# EAGLE schematic tennisfortwof303 (EAGLE 9.6.2)
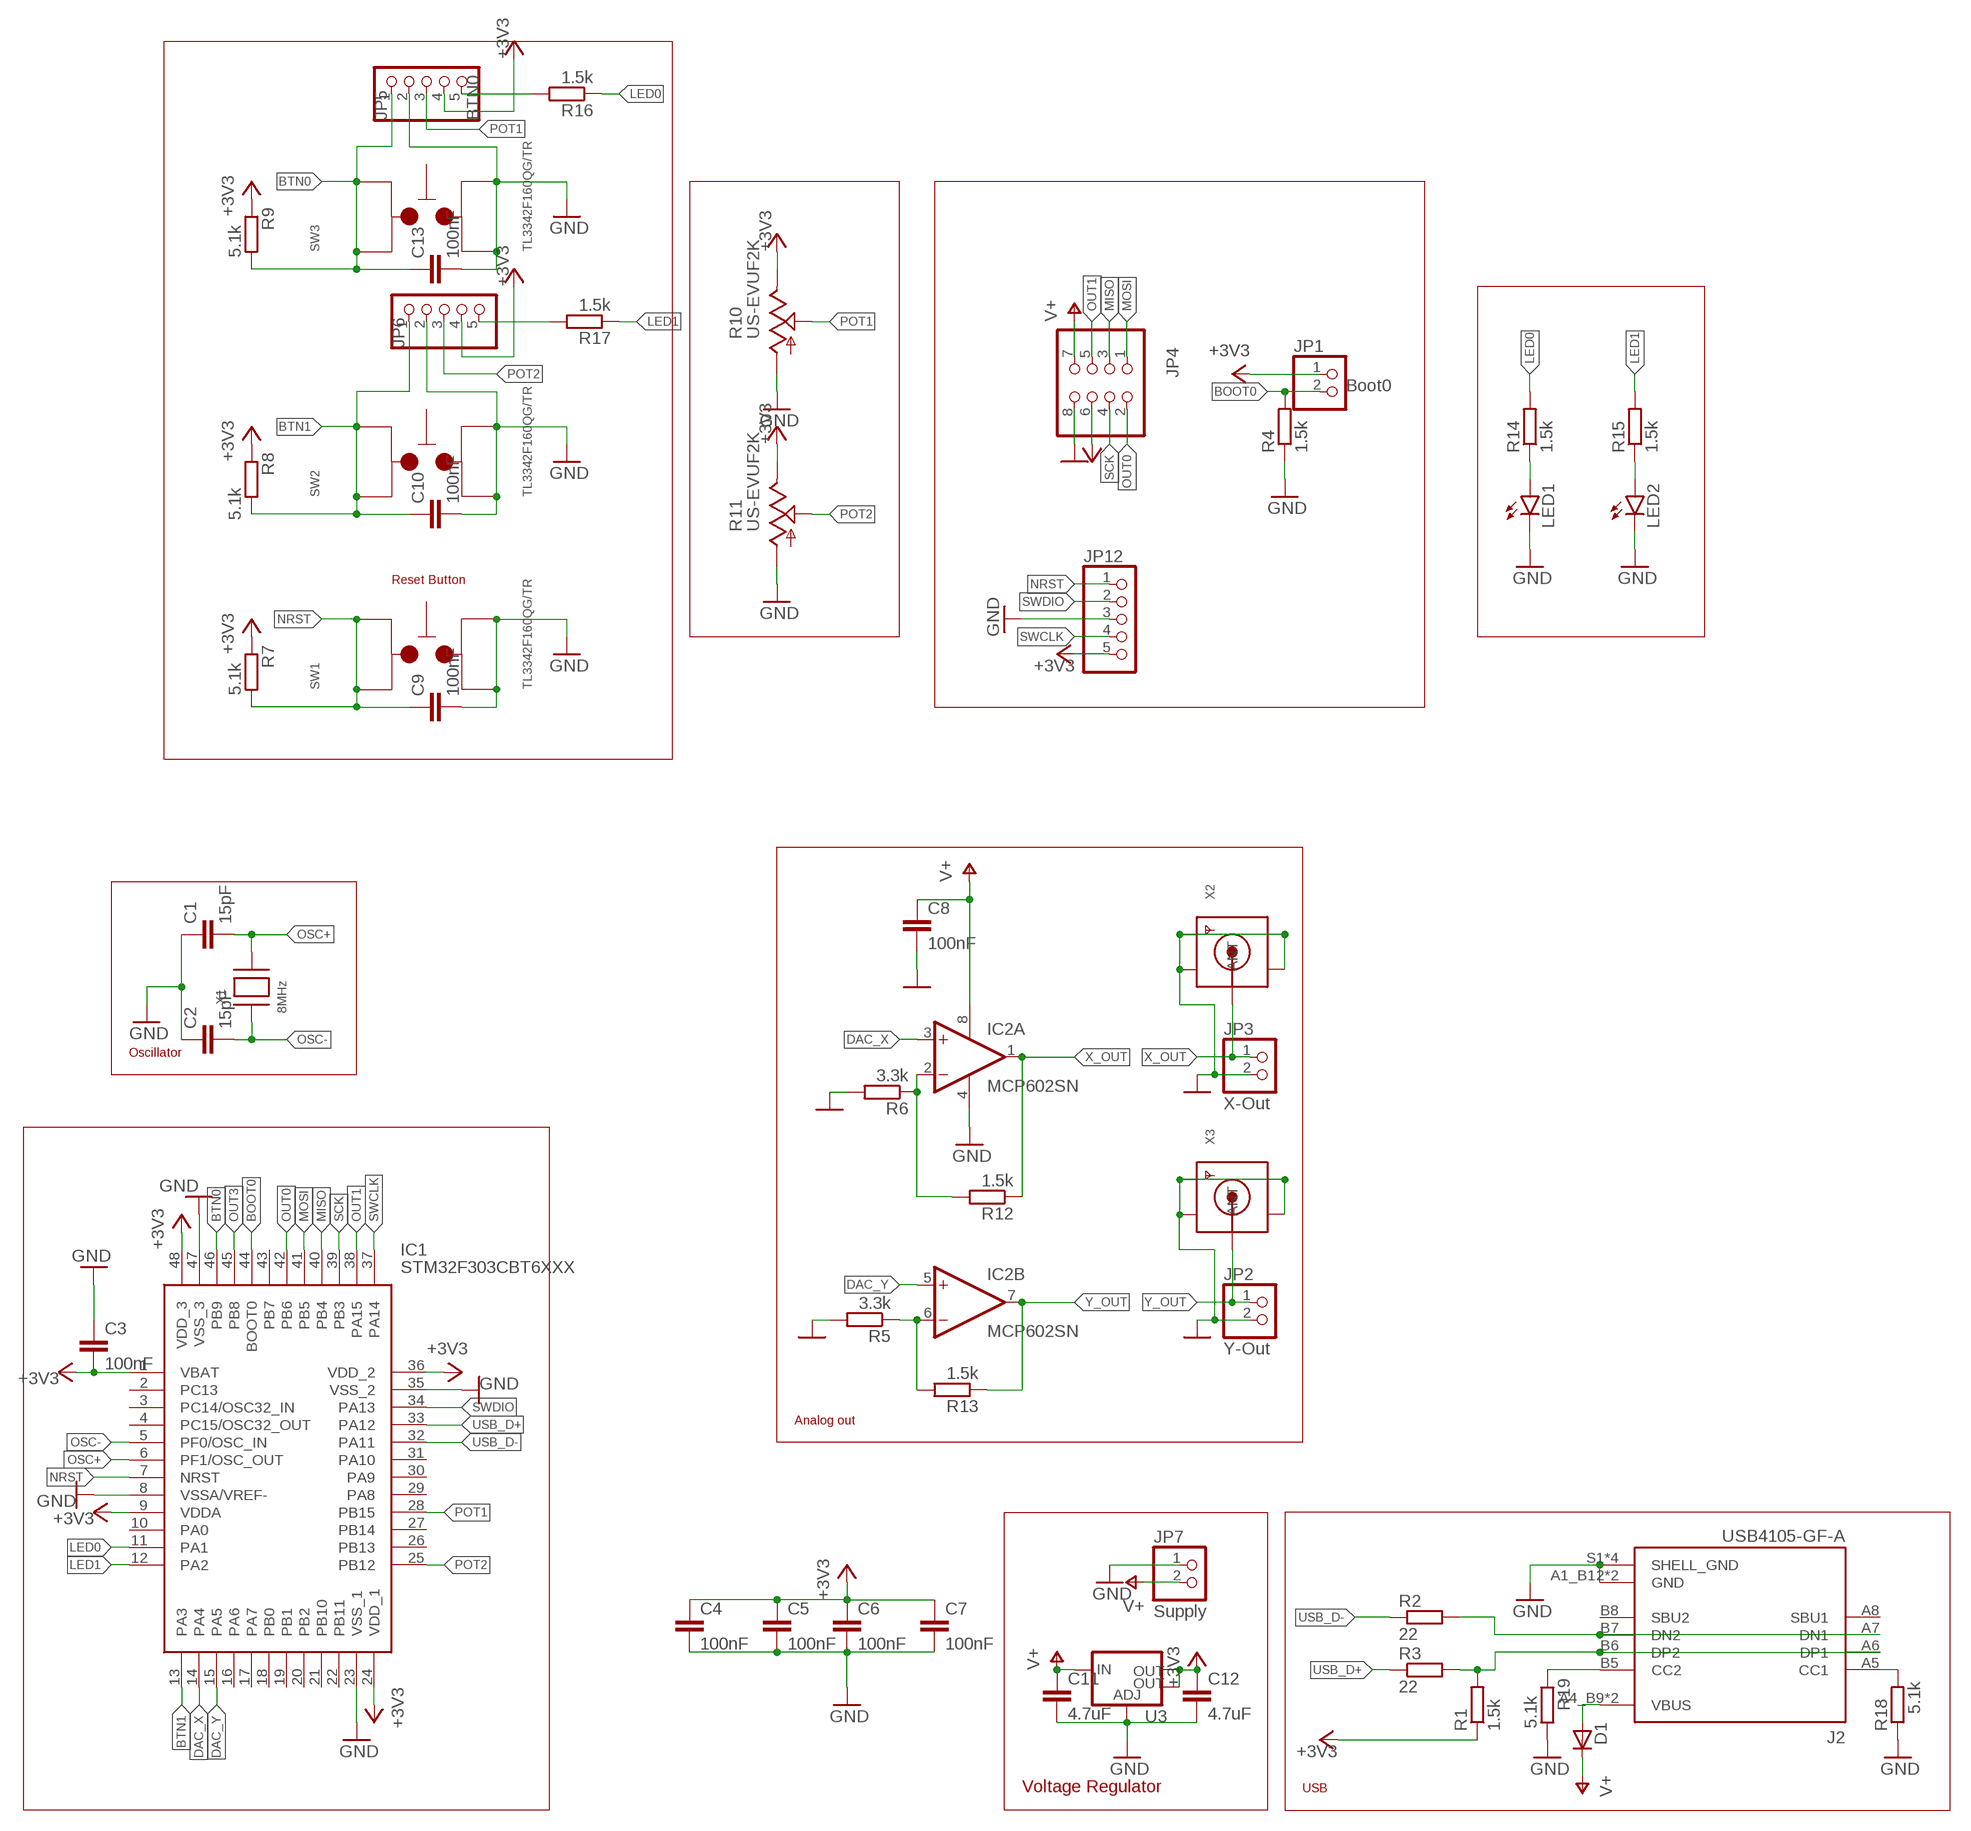
[diagram p0: schematic, sheet 1]

## Parts
C1  15pF  C-EUC0603  [C0603]
C2  15pF  C-EUC0603  [C0603]
C3  100nF  C-EUC0603  [C0603]
C4  100nF  C-EUC0603  [C0603]
C5  100nF  C-EUC0603  [C0603]
C6  100nF  C-EUC0603  [C0603]
C7  100nF  C-EUC0603  [C0603]
C8  100nF  C-EUC0603  [C0603]
C9  100nF  C-EUC0603  [C0603]
C10  100nF  C-EUC0603  [C0603]
C11  4.7uF  C-EUC0805  [C0805]
C12  4.7uF  C-EUC0805  [C0805]
C13  100nF  C-EUC0603  [C0603]
D1  DIODESMA  [SMADIODE]
IC1  STM32F303CBT6XXX  [QFP50P900X900X160-48N]
IC2  MCP602SN  [SO08]
J2  USB4105-GF-A  [GCT_USB4105-GF-A]
JP1  Boot0  PINHD-1X2  [1X02]
JP2  Y-Out  PINHD-1X2  [1X02]
JP3  X-Out  PINHD-1X2  [1X02]
JP4  PINHD-2X4  [2X04]
JP5  BTN0  PINHD-1X5/90  [1X05/90]
JP6  BTN1  PINHD-1X5/90  [1X05/90]
JP7  Supply  PINHD-1X2  [1X02]
JP12  PINHD-1X5  [1X05]
LED1  LEDCHIPLED_0805  [CHIPLED_0805]
LED2  LEDCHIPLED_0805  [CHIPLED_0805]
R1  1.5k  R-EU_R0603  [R0603]
R2  22  R-EU_R0603  [R0603]
R3  22  R-EU_R0603  [R0603]
R4  1.5k  R-EU_R0603  [R0603]
R5  3.3k  R-EU_R0603  [R0603]
R6  3.3k  R-EU_R0603  [R0603]
R7  5.1k  R-EU_R0603  [R0603]
R8  5.1k  R-EU_R0603  [R0603]
R9  5.1k  R-EU_R0603  [R0603]
R10  US-EVUF2K  [EVUFXK]
R11  US-EVUF2K  [EVUFXK]
R12  1.5k  R-EU_R0603  [R0603]
R13  1.5k  R-EU_R0603  [R0603]
R14  1.5k  R-EU_R0603  [R0603]
R15  1.5k  R-EU_R0603  [R0603]
R16  1.5k  R-EU_R0603  [R0603]
R17  1.5k  R-EU_R0603  [R0603]
R18  5.1k  R-EU_R0603  [R0603]
R19  5.1k  R-EU_R0603  [R0603]
SW1  TL3342F160QG/TR  [TL3342F160QG/TR]
SW2  TL3342F160QG/TR  [TL3342F160QG/TR]
SW3  TL3342F160QG/TR  [TL3342F160QG/TR]
U3  V_REG_LM1117SOT223  [SOT223]
X1  8MHz  XTALNX5032  [NX5032]
X2  SMACONNECTOR_EDGE  [SMA_EDGELAUNCH]
X3  SMACONNECTOR_EDGE  [SMA_EDGELAUNCH]

## Nets
+3V3: C3.2 C4.1 C5.1 C6.1 C7.1 C12.1 IC1.1(VBAT) IC1.9(VDDA) IC1.24(VDD_1) IC1.36(VDD_2) IC1.48(VDD_3) JP1.1 JP4.6 JP5.4 JP6.4 JP12.5 R1.1 R7.1 R8.1 R9.1 R10.3(E) R11.3(E) U3.2(OUT) U3.4(OUT)
BOOT0: IC1.44(BOOT0) JP1.2 R4.2
BTN0: C13.1 IC1.46(PB9) JP5.1 R9.2 SW3.3 SW3.4
BTN1: C10.1 IC1.13(PA3) JP6.1 R8.2 SW2.3 SW2.4
DAC_X: IC1.14(PA4) IC2.3(A:+IN)
DAC_Y: IC1.15(PA5) IC2.5(B:+IN)
GND: C1.1 C2.1 C3.1 C4.2 C5.2 C6.2 C7.2 C8.2 C9.2 C10.2 C11.2 C12.2 C13.2 IC1.8(VSSA/VREF-) IC1.23(VSS_1) IC1.35(VSS_2) IC1.47(VSS_3) IC2.4(P:V-) J2.A1_B12(GND) J2.B1_A12(GND) J2.S1(SHELL_GND) J2.S2(SHELL_GND) J2.S3(SHELL_GND) J2.S4(SHELL_GND) JP2.2 JP3.2 JP4.8 JP5.2 JP6.2 JP7.1 JP12.3 LED1.C LED2.C R4.1 R5.2 R6.2 R10.1(A) R11.1(A) R18.1 R19.2 SW1.1 SW1.2 SW2.1 SW2.2 SW3.1 SW3.2 U3.1(ADJ) X2.GND@1(GND4) X2.GND@2(GND3) X2.GND@3(GND2) X2.GND@4(GND1) X3.GND@1(GND4) X3.GND@2(GND3) X3.GND@3(GND2) X3.GND@4(GND1)
LED0: IC1.11(PA1) R14.2 R16.1
LED1: IC1.12(PA2) R15.2 R17.1
MISO: IC1.40(PB4) JP4.3
MOSI: IC1.41(PB5) JP4.1
N$2: D1.A J2.A4_B9(VBUS) J2.B4_A9(VBUS)
N$3: LED1.A R14.1
N$4: LED2.A R15.1
N$5: J2.A7(DN1) J2.B7(DN2) R2.2
N$6: J2.A6(DP1) J2.B6(DP2) R1.2 R3.2
N$7: IC2.2(A:-IN) R6.1 R12.2
N$8: IC2.6(B:-IN) R5.1 R13.2
N$9: JP5.5 R16.2
N$10: JP6.5 R17.2
N$11: J2.A5(CC1) R18.2
N$12: J2.B5(CC2) R19.1
NRST: C9.1 IC1.7(NRST) JP12.1 R7.2 SW1.3 SW1.4
OSC+: C1.2 IC1.6(PF1/OSC_OUT) X1.P$2
OSC-: C2.2 IC1.5(PF0/OSC_IN) X1.P$1
OUT0: IC1.42(PB6) JP4.2
OUT1: IC1.38(PA15) JP4.5
OUT3: IC1.45(PB8)
POT1: IC1.28(PB15) JP5.3 R10.2(S)
POT2: IC1.25(PB12) JP6.3 R11.2(S)
SCK: IC1.39(PB3) JP4.4
SWCLK: IC1.37(PA14) JP12.4
SWDIO: IC1.34(PA13) JP12.2
USB_D+: IC1.33(PA12) R3.1
USB_D-: IC1.32(PA11) R2.1
V+: C8.1 C11.1 D1.C IC2.8(P:V+) JP4.7 JP7.2 U3.3(IN)
X_OUT: IC2.1(A:OUT) JP3.1 R12.1 X2.P(ANT)
Y_OUT: IC2.7(B:OUT) JP2.1 R13.1 X3.P(ANT)
Unconnected: IC1.2(PC13) IC1.3(PC14/OSC32_IN) IC1.4(PC15/OSC32_OUT) IC1.10(PA0) IC1.16(PA6) IC1.17(PA7) IC1.18(PB0) IC1.19(PB1) IC1.20(PB2) IC1.21(PB10) IC1.22(PB11) IC1.26(PB13) IC1.27(PB14) IC1.29(PA8) IC1.30(PA9) IC1.31(PA10) IC1.43(PB7) J2.A8(SBU1) J2.B8(SBU2)

## Notes on the sheet
- Reset Button
- Oscillator
- Analog out
- Voltage Regulator | USB

## Library data of the parts
C1-C13 = resistor:C-EU: CAPACITOR, European symbol
D1 = adafruit:DIODE: Diode SMADIODE - SMA Surface Mount Package 20V 1A Schottky Diode Digikey: 641-1014-6-ND DO-1N4148 - Through Hole Small Current Diode SOD-123 20V 1 A (.5mV Vf) Schottky Diode - Digikey: MBRX120TPMSCT-ND SOD-323 10V 570mA (.38mV Vf, 3ns) Schottky Diode - Digikey: ZLLS410CT-ND SOD-523 30V 30mA Schottky Diode (RB751S-40TE61) - Digikey: RB751S-40TE61CT-ND SOT23-R/W - SOT23 Package (R = Solder Paste/Reflow Ovens, W = Hand-Soldering) BAT54Film 40V 300mA - Digikey: 497-7162-1-ND
IC1 = SamacSys_Parts:STM32F303CBT6XXX: STM32F303CBT6XXX Source: Datasheet <https://4donline.ihs.com/images/VipMasterIC/IC/SGST/SGST-S-A0006621340/SGST-S-A0006621340-1.pdf?hkey=EF798316E3902B6ED9A73243A3159BB0>; DESCRIPTION: STM32F303CBT6XXX; HEIGHT: 1.6mm; MANUFACTURER_NAME: STMicroelectronics; MANUFACTURER_PART_NUMBER: STM32F303CBT6XXX
IC2 = linear:MCP602: Single Op Amp 2.7V to 6.0V Single Supply CMOS Source: http://ww1.microchip.com/downloads/en/DeviceDoc/21314g.pdf
J2 = USB4105-GF-A:USB4105-GF-A: USB-C (USB TYPE-C) USB 2.0 Receptacle Connector 24 (16+8 Dummy) Position Surface Mount, Right Angle; Through Hole Check availability <https://pricing.snapeda.com/parts/USB4105-GF-A/GCT/view-part?ref=eda>; AVAILABILITY: In Stock; DESCRIPTION: USB-C (USB TYPE-C) USB 2.0 Receptacle Connector 24 (16+8 Dummy) Position Surface Mount, Right Angle; Through Hole; MF: GCT; MP: USB4105-GF-A; PACKAGE: None; PRICE: None; PURCHASE-URL: https://pricing.snapeda.com/search/part/USB4105-GF-A/?ref=eda
JP1-JP3 JP7 = pinhead:PINHD-1X2: PIN HEADER
JP4 = pinhead:PINHD-2X4: PIN HEADER
JP5 JP6 JP12 = pinhead:PINHD-1X5: PIN HEADER
LED1 LED2 = led:LED: LED OSRAM: - CHIPLED LG R971, LG N971, LY N971, LG Q971, LY Q971, LO R971, LY R971 LH N974, LH R974 LS Q976, LO Q976, LY Q976 LO Q996 - Hyper CHIPLED LW Q18S LB Q993, LB Q99A, LB R99A - SideLED LS A670, LO A670, LY A670, LG A670, LP A670 LB A673, LV A673, LT A673, LW A673 LH A674 LY A675 LS A676, LA A676, LO A676, LY A676, LW A676 LS A679, LY A679, LG A679 - Hyper Micro SIDELED® LS Y876, LA Y876, LO Y876, LY Y876 LT Y87S - SmartLED LW L88C, LW L88S LB L89C, LB L89S, LG L890 LS L89K, LO L89K, LY L89K LS L896, LA L896, LO L896, LY L896 - TOPLED LS T670, LO T670, LY T670, LG T670, LP T670 LSG T670, LSP T670, LSY T670, LOP T670, LYG T670 LG T671, LOG T671, LSG T671 LB T673, LV T673, LT T673, LW T673 LH T674 LS T676, LA T676, LO T676, LY T676, LB T676, LH T676, LSB T676, LW T676 LB T67C, LV T67C, LT T67C, LS T67K, LO T67K, LY T67K, LW E67C LS E67B, LA E67B, LO E67B, LY E67B, LB E67C, LV E67C, LT E67C LW T67C LS T679, LY T679, LG T679 LS T770, LO T770, LY T770, LG T770, LP T770 LB T773, LV T773, LT T773, LW T773 LH T774 LS E675, LA E675, LY E675, LS T675 LS T776, LA T776, LO T776, LY T776, LB T776 LHGB T686 LT T68C, LB T68C - Hyper Mini TOPLED® LB M676 - Mini TOPLED Santana® LG M470 LS M47K, LO M47K, LY M47K Source: http://www.osram.convergy.de LUXEON: - LUMILED® LXK2-PW12-R00, LXK2-PW12-S00, LXK2-PW14-U00, LXK2-PW14-V00 LXK2-PM12-R00, LXK2-PM12-S00, LXK2-PM14-U00 LXK2-PE12-Q00, LXK2-PE12-R00, LXK2-PE12-S00, LXK2-PE14-T00, LXK2-PE14-U00 LXK2-PB12-K00, LXK2-PB12-L00, LXK2-PB12-M00, LXK2-PB14-N00, LXK2-PB14-P00, LXK2-PB14-Q00 LXK2-PR12-L00, LXK2-PR12-M00, LXK2-PR14-Q00, LXK2-PR14-R00 LXK2-PD12-Q00, LXK2-PD12-R00, LXK2-PD12-S00 LXK2-PH12-R00, LXK2-PH12-S00 LXK2-PL12-P00, LXK2-PL12-Q00, LXK2-PL12-R00 Source: www.luxeon.com KINGBRIGHT: KA-3528ASYC Source: www.kingbright.com
R1-R9 R12-R19 = resistor:R-EU_: RESISTOR, European symbol
R10 R11 = pot:US-EVU: 9 mm Square Rotary Potentiometers Source: Panasonic
SW1-SW3 = Switch:TL3342F160QG/TR: SWITCH TACTILE SPST-NO 0.05A 12V Manufacturer's datasheet <http://spec_sheets.e-switch.com/specs/P010632.pdf>; CREATED_BY: PCBLayout.com; DIGI_KEY_PART_NUMBER: EG2531CT-ND; MANUFACTURER: E-Switch; MPN: TL3342F160QG/TR; PACKAGE: SPST_NO
U3 = SparkFun-IC-Power:V_REG_LM1117: Voltage Regulator LM1117 Standard adjustable voltage regulator but in SMD form. Spark Fun Electronics SKU : COM-00595; PROD_ID: VREG-08170
X1 = adafruit:XTAL: Low cost SMT crystals, no capacitors included http://www.ladyada.net/library/eagle
X2 X3 = adafruit:SMACONNECTOR: SMA Connector 90° DIP SMA Connector, 50 Ohm (4UConnector: 07259)